# EAGLE design wind_speed (EAGLE 6.5.0)
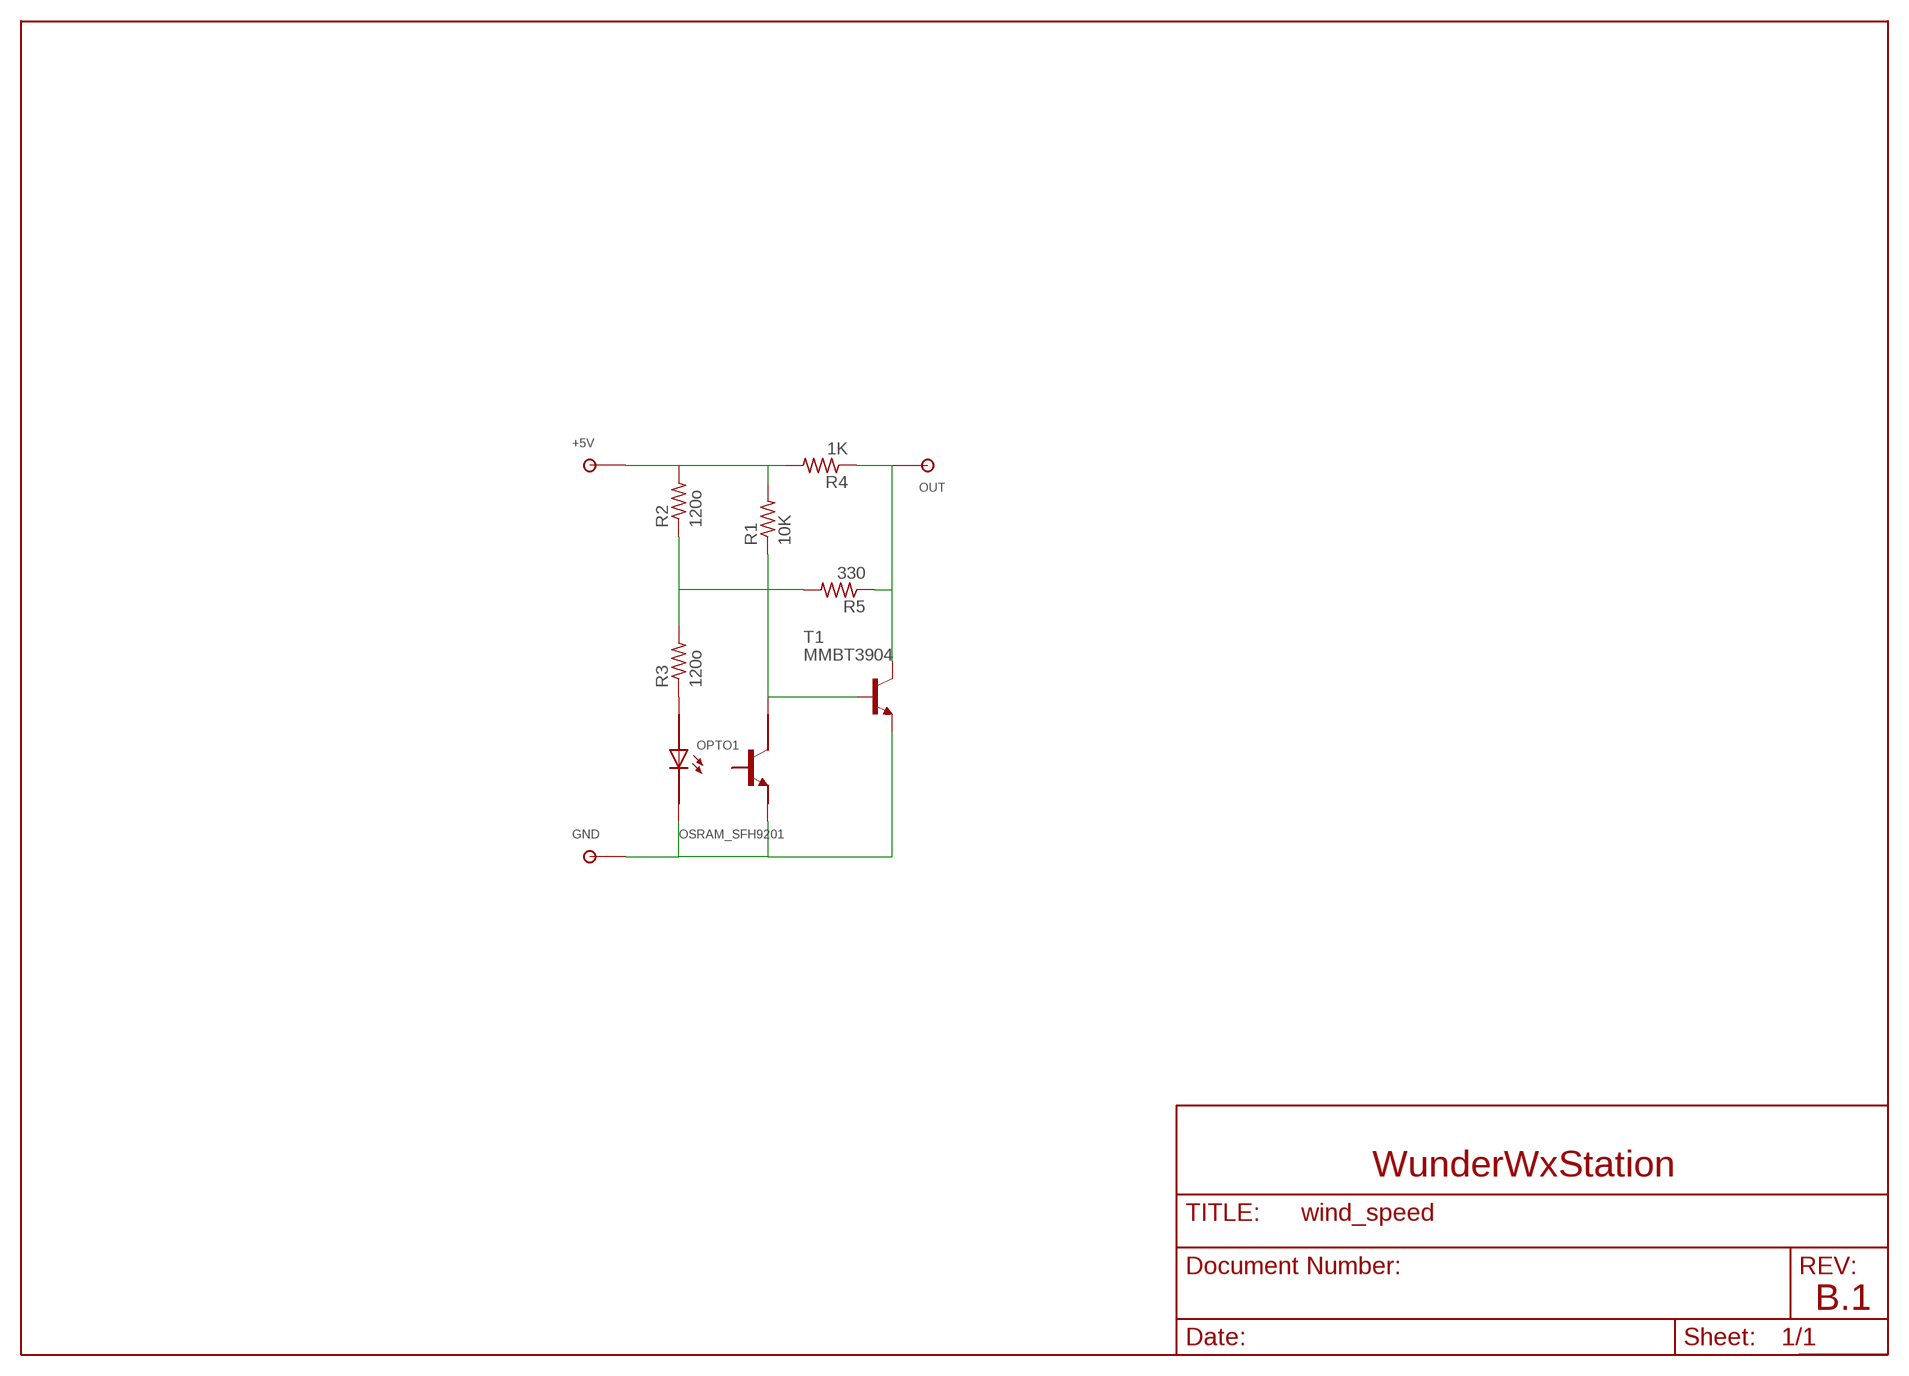
[diagram p0: schematic, sheet 1]

## Parts
+5V  TPSOL  [TP_SOL]
GND  TPSOL  [TP_SOL]
OPTO1  OSRAM_SFH9201  OSRAM_SHF9201  [OSRAM-6]
OUT  TPSOL  [TP_SOL]
R1  10K  R-US_R0603  [R0603]
R2  120o  R-US_R0603  [R0603]
R3  120o  R-US_R0603  [R0603]
R4  1K  R-US_R0603  [R0603]
R5  330  R-US_R0603  [R0603]
T1  MMBT3904  BC846  [SOT23]

## Nets
N$1: OPTO1.P$4(C) R1.1 T1.1(B)
N$2: GND.P$1 OPTO1.P$3(E) OPTO1.P$6(CATH) T1.2(E)
N$3: +5V.P$1 R1.2 R2.2 R4.2
N$4: OUT.P$1 R4.1 R5.1 T1.3(C)
N$5: OPTO1.P$1(AN) R3.1
N$6: R2.1 R3.2 R5.2
Unconnected: OPTO1.P$2 OPTO1.P$5

## Notes on the sheet
- WunderWxStation
- B.1

## Library data of the parts
+5V GND OUT = wifi_WX:TP
OPTO1 = wifi_WX:OSRAM_SHF9201: Osram reflective opto interrupter
R1-R5 = rcl:R-US_: RESISTOR, American symbol
T1 = transistor:BC846: NPN TRANSISTOR

## Board
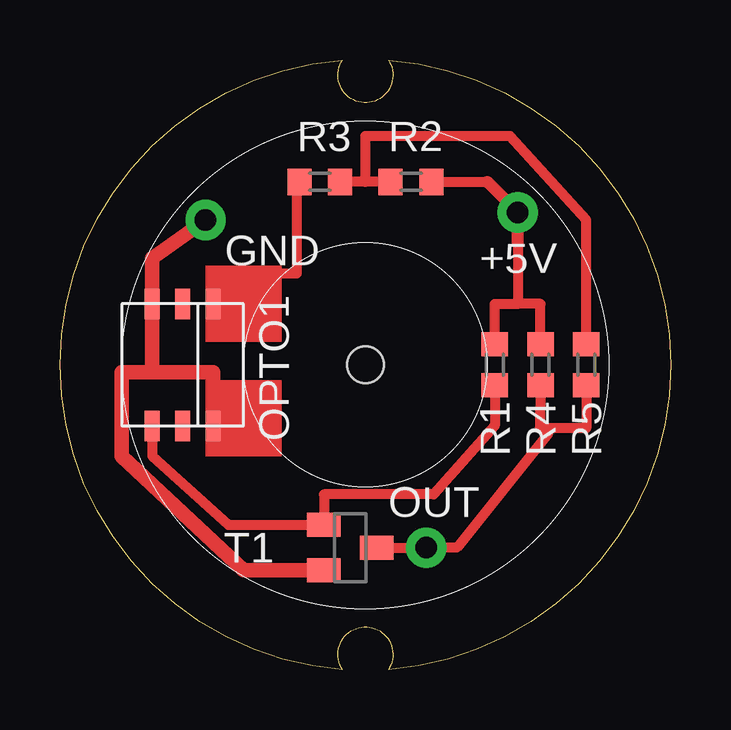
[diagram p1: board, top side]
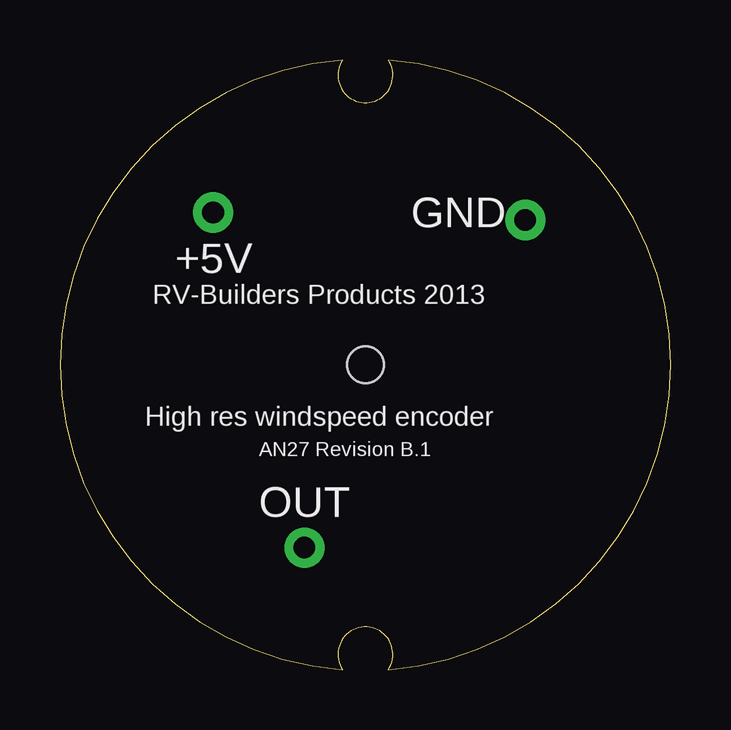
[diagram p2: board, bottom side, seen from below]

Size 25.47 x 25.4 mm. Coordinates in mm from the lower left corner, seen from the top.
Outline: 13.69,25.4 arc-171 13.69,0 arc247 11.78,0 arc-171 11.78,25.4 arc247 13.69,25.4
Copper layers (1*16): Top 0.035mm / dielectric 1.5mm / Bottom 0.035mm
Design rules "Elecrow_2-layer_with reduced cream mask *": minimum track width 6mil, minimum drill 12mil, track to track 6mil, track to pad 6mil, pad to pad 6mil, via to via 6mil, smd to smd 0mil, copper to edge 10mil, drill to drill 10mil, minimum pad ring 10mil, minimum via ring 6mil, stop-mask expansion 2mil, vias tented up to drill 100mil, thermal gap 10mil
Holes 1.52 mm at 12.74,12.7

### Footprints (pad centres in the part's own frame; a part is rotated, then mirrored left to right if it is on the bottom)
TP_SOL = drill 0.9 pad 1.676: P$1 0,0
OSRAM-6 = smd 0.635 x 1.27: P$1 0,-1.27; P$2 1.27,-1.27; P$3 2.54,-1.27; P$4 2.54,3.81; P$5 1.27,3.81; P$6 0,3.81
R0603 = smd 1 x 1.1: 1 -0.85,0; 2 0.85,0
SOT23 = smd 1 x 1.4: 1 -0.95,-1.1; 2 0.95,-1.1; 3 0,1.1

### Placement (x,y rotation side)
+5V  19.09,19.05 0 top
GND  6.07,18.73 0 top
OPTO1  6.39,13.97 180 top
OUT  15.28,5.08 0 top
R1  18.13,12.7 90 top
R2  14.64,20.32 0 top
R3  10.83,20.32 0 top
R4  20.04,12.7 90 top
R5  21.94,12.7 90 top
T1  12.1,5.08 270 top

### Tracks (layer width: path | path; a pad name or v marks a point on that pad's centre or on a via)
N$1
  Top 0.406: R1.1 18.13,10.16 15.59,7.3 11,7.3 T1.1 7.02,6.03 3.85,8.89 OPTO1.P$4
N$2
  Top 0.61: 3.85,12.38 OPTO1.P$3 3.85,17.14 GND.P$1 | 3.85,12.38 6.39,12.38 OPTO1.P$6 | 3.85,12.38 2.58,12.38 2.58,8.89 7.65,4.13 T1.2
N$3
  Top 0.406: R2.2 17.82,20.32 | 19.09,17.78 19.09,15.24 | R4.2 20.04,15.24 19.09,15.24 | R1.2 18.13,15.24 19.09,15.24
  Top 0.508: 17.82,20.32 +5V.P$1 19.09,17.78
N$4
  Top 0.406: T1.3 OUT.P$1 16.55,5.08 20.36,9.84 20,10.05 | R4.1 20,10.05 | R5.1 21.94,10.05 20,10.05
N$5
  Top 0.406: OPTO1.P$1 6.39,16.51 9.88,16.51 9.88,20.32 R3.1
N$6
  Top 0.406: R3.2 R2.1 12.74,20.32 12.74,22.23 18.77,22.23 21.94,18.73 R5.2
(copper drawn outside any net)
  shapes: Top area x2

### Text on the board
bPlace: GND | +5V | RV-Builders Products 2013 | High res windspeed encoder | AN27 Revision B.1 | OUT